# EAGLE schematic Aerobal Schematic v1 (EAGLE 6.3)
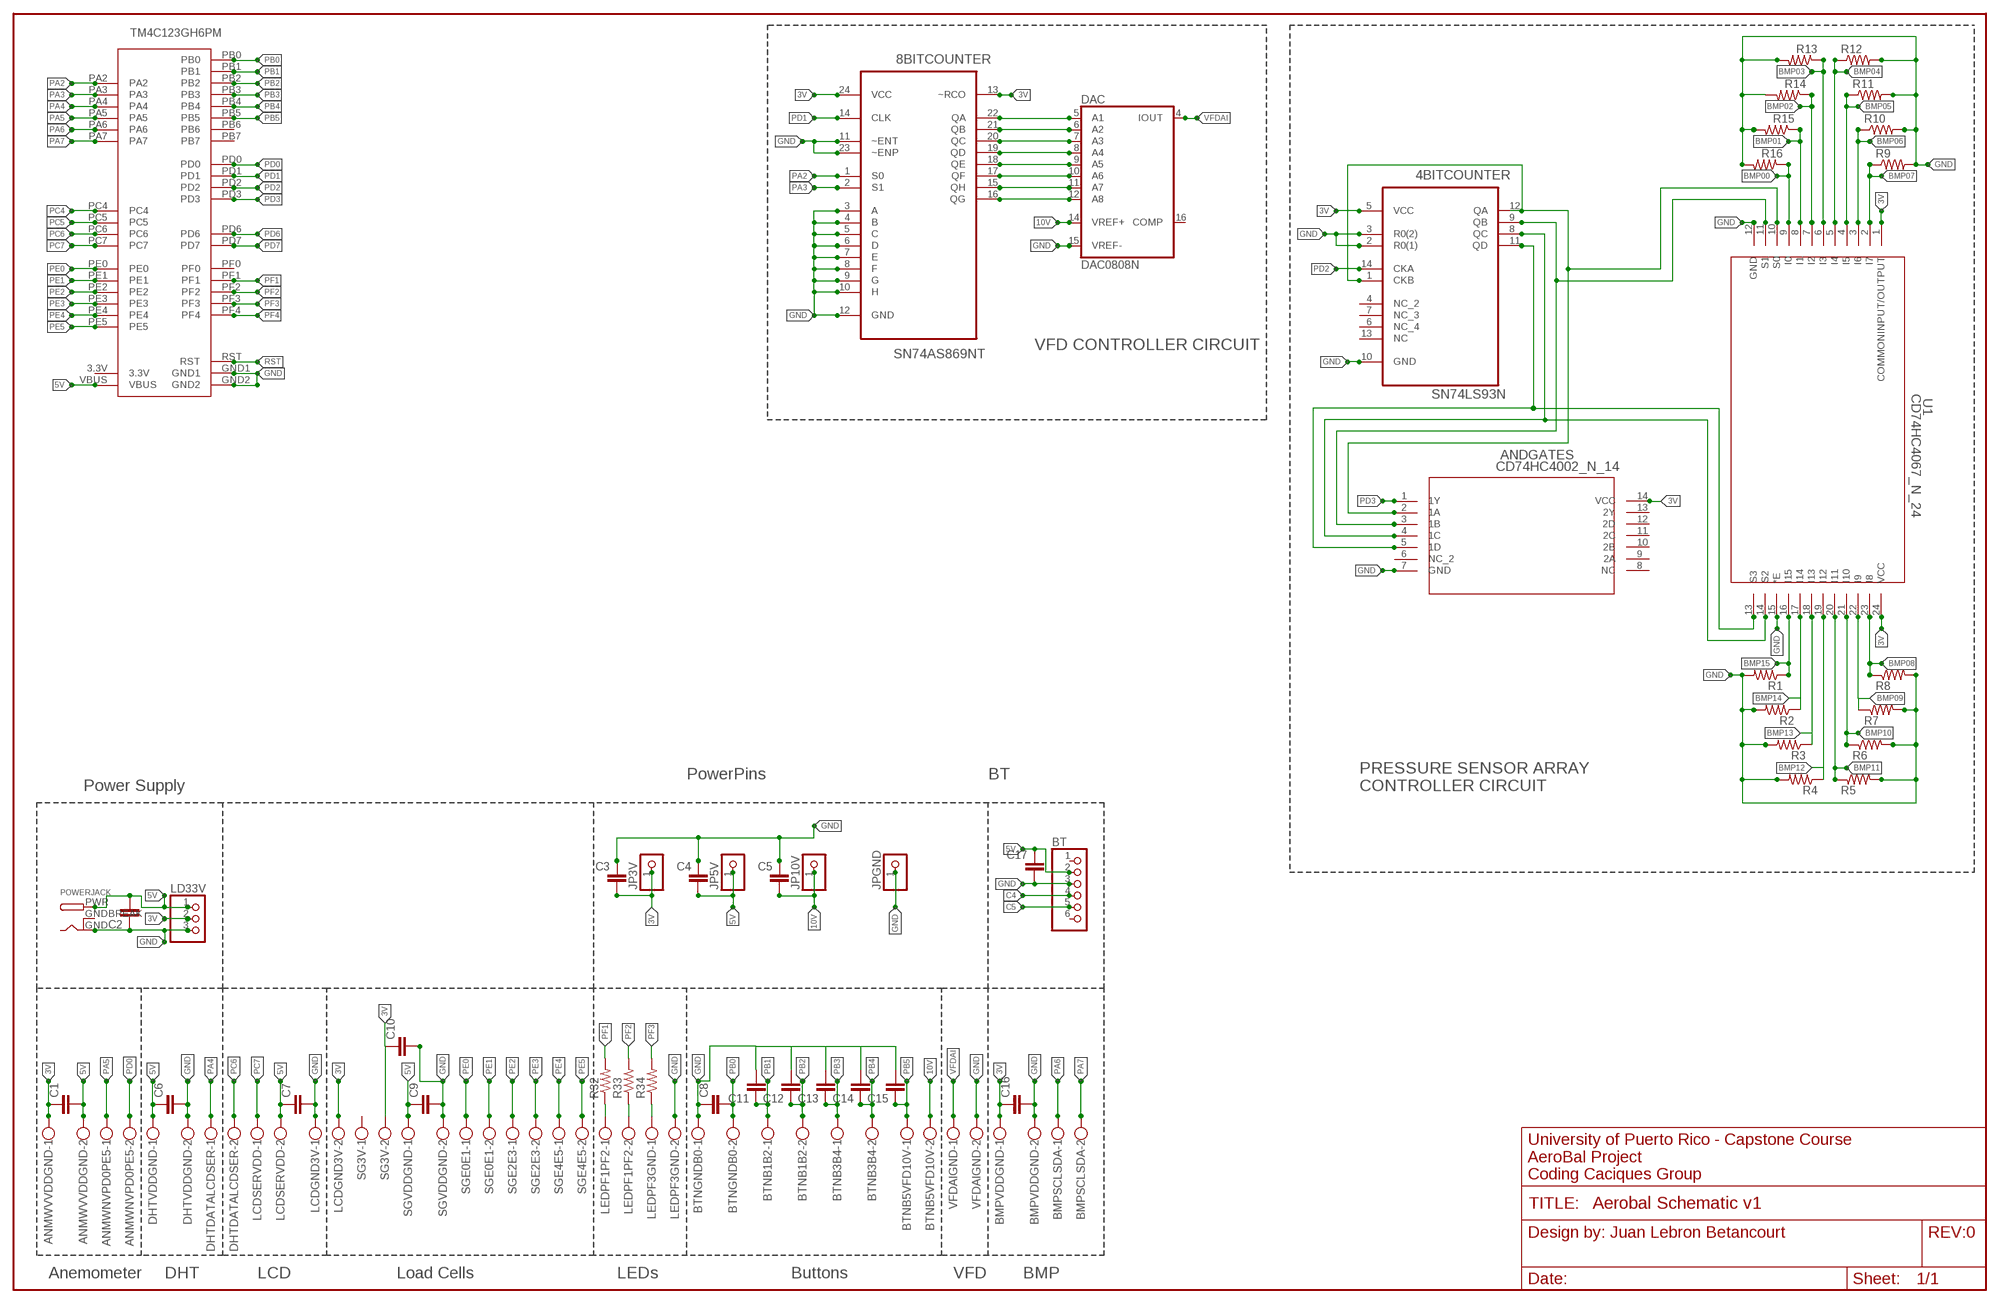
[diagram p0: schematic, sheet 1]

## Parts
4BITCOUNTER  SN74LS93N  [DIP254P762X508-14]
8BITCOUNTER  SN74AS869NT  [DIP254P762X508-24]
ANDGATES  CD74HC4002_N_14  [N14]
ANMWNVPD0PE5  W237-102  [W237-102]
ANMWVVDDGND  W237-102  [W237-102]
BMPSCLSDA  W237-102  [W237-102]
BMPVDDGND  W237-102  [W237-102]
BT  PINHD-1X6  [1X06]
BTNB1B2  W237-102  [W237-102]
BTNB3B4  W237-102  [W237-102]
BTNB5VFD10V  W237-102  [W237-102]
BTNGNDB0  W237-102  [W237-102]
C1  C-EU025-025X050  [C025-025X050]
C2  C-EU025-025X050  [C025-025X050]
C3  C-EU025-025X050  [C025-025X050]
C4  C-EU025-025X050  [C025-025X050]
C5  C-EU025-025X050  [C025-025X050]
C6  C-EU025-025X050  [C025-025X050]
C7  C-EU025-025X050  [C025-025X050]
C8  C-EU025-025X050  [C025-025X050]
C9  C-EU025-025X050  [C025-025X050]
C10  C-EU025-025X050  [C025-025X050]
C11  C-EU025-025X050  [C025-025X050]
C12  C-EU025-025X050  [C025-025X050]
C13  C-EU025-025X050  [C025-025X050]
C14  C-EU025-025X050  [C025-025X050]
C15  C-EU025-025X050  [C025-025X050]
C16  C-EU025-025X050  [C025-025X050]
C17  C-EU025-025X050  [C025-025X050]
DAC  DAC0808N  [DIL16]
DHTDATALCDSER  W237-102  [W237-102]
DHTVDDGND  W237-102  [W237-102]
FRAME1  FRAME-LEDGER  [CREATIVE_COMMONS]
JP3V  PINHD-1X1  [1X01]
JP5V  PINHD-1X1  [1X01]
JP10V  PINHD-1X1  [1X01]
JPGND  PINHD-1X1  [1X01]
LCDGND3V  W237-102  [W237-102]
LCDSERVDD  W237-102  [W237-102]
LD33V  PINHD-1X3  [1X03]
LEDPF1PF2  W237-102  [W237-102]
LEDPF3GND  W237-102  [W237-102]
POWERJACK  DCBARRELPTH  [DCJACK_2MM_PTH]
R1  RESISTORPTH-1/4W  [AXIAL-0.4]
R2  RESISTORPTH-1/4W  [AXIAL-0.4]
R3  RESISTORPTH-1/4W  [AXIAL-0.4]
R4  RESISTORPTH-1/4W  [AXIAL-0.4]
R5  RESISTORPTH-1/4W  [AXIAL-0.4]
R6  RESISTORPTH-1/4W  [AXIAL-0.4]
R7  RESISTORPTH-1/4W  [AXIAL-0.4]
R8  RESISTORPTH-1/4W  [AXIAL-0.4]
R9  RESISTORPTH-1/4W  [AXIAL-0.4]
R10  RESISTORPTH-1/4W  [AXIAL-0.4]
R11  RESISTORPTH-1/4W  [AXIAL-0.4]
R12  RESISTORPTH-1/4W  [AXIAL-0.4]
R13  RESISTORPTH-1/4W  [AXIAL-0.4]
R14  RESISTORPTH-1/4W  [AXIAL-0.4]
R15  RESISTORPTH-1/4W  [AXIAL-0.4]
R16  RESISTORPTH-1/4W  [AXIAL-0.4]
R32  RESISTORPTH-1/4W  [AXIAL-0.4]
R33  RESISTORPTH-1/4W  [AXIAL-0.4]
R34  RESISTORPTH-1/4W  [AXIAL-0.4]
SG3V  W237-102  [W237-102]
SGE0E1  W237-102  [W237-102]
SGE2E3  W237-102  [W237-102]
SGE4E5  W237-102  [W237-102]
SGVDDGND  W237-102  [W237-102]
TM4C123GH6PM  STELLARIS-LAUNCHPADSTELLARIS-LAUNCHPAD  [LAUNCHPAD-XL]
U1  CD74HC4067_N_24  [N24]
VFDAIGND  W237-102  [W237-102]

## Nets
3V: 4BITCOUNTER.5(VCC) 8BITCOUNTER.13(~RCO) 8BITCOUNTER.24(VCC) ANDGATES.14(VCC) ANMWVVDDGND.1 BMPVDDGND.1 C1.1 C3.2 C10.1 C16.1 JP3V.1 LCDGND3V.2 LD33V.2 SG3V.2 U1.1(COMMONINPUT/OUTPUT) U1.24(VCC)
5V: ANMWVVDDGND.2 BT.2 C1.2 C2.2 C4.2 C6.1 C7.1 C9.1 C17.1 DHTVDDGND.1 JP5V.1 LCDSERVDD.2 LD33V.1 POWERJACK.PWR SGVDDGND.1 TM4C123GH6PM.VBUS
10V: BTNB5VFD10V.2 C5.2 DAC.14(VREF+) JP10V.1
BMP00: R16.P$1 U1.9(I0)
BMP01: R15.P$1 U1.8(I1)
BMP02: R14.P$1 U1.7(I2)
BMP03: R13.P$1 U1.6(I3)
BMP04: R12.P$1 U1.5(I4)
BMP05: R11.P$1 U1.4(I5)
BMP06: R10.P$1 U1.3(I6)
BMP07: R9.P$1 U1.2(I7)
BMP08: R8.P$1 U1.23(I8)
BMP09: R7.P$1 U1.22(I9)
BMP10: R6.P$1 U1.21(I10)
BMP11: R5.P$1 U1.20(I11)
BMP12: R4.P$1 U1.19(I12)
BMP13: R3.P$1 U1.18(I13)
BMP14: R2.P$1 U1.17(I14)
BMP15: R1.P$1 U1.16(I15)
C4: BT.4
C5: BT.5
GND: 4BITCOUNTER.2(R0(1)) 4BITCOUNTER.3(R0(2)) 4BITCOUNTER.10(GND) 8BITCOUNTER.3(A) 8BITCOUNTER.4(B) 8BITCOUNTER.5(C) 8BITCOUNTER.6(D) 8BITCOUNTER.7(E) 8BITCOUNTER.8(F) 8BITCOUNTER.9(G) 8BITCOUNTER.10(H) 8BITCOUNTER.11(~ENT) 8BITCOUNTER.12(GND) 8BITCOUNTER.23(~ENP) ANDGATES.7(GND) BMPVDDGND.2 BT.3 BTNGNDB0.1 C2.1 C3.1 C4.1 C5.1 C6.2 C7.2 C8.1 C9.2 C10.2 C11.2 C12.2 C13.2 C14.2 C15.2 C16.2 C17.2 DAC.15(VREF-) DHTVDDGND.2 JPGND.1 LCDGND3V.1 LD33V.3 LEDPF3GND.2 POWERJACK.GND R1.P$2 R2.P$2 R3.P$2 R4.P$2 R5.P$2 R6.P$2 R7.P$2 R8.P$2 R9.P$2 R10.P$2 R11.P$2 R12.P$2 R13.P$2 R14.P$2 R15.P$2 R16.P$2 SGVDDGND.2 TM4C123GH6PM.GND1 TM4C123GH6PM.GND2 U1.12(GND) U1.15(*E) VFDAIGND.2
N$1: LEDPF1PF2.1 R32.P$1
N$3: LEDPF1PF2.2 R33.P$1
N$4: LEDPF3GND.1 R34.P$1
N$51: 4BITCOUNTER.11(QD) ANDGATES.5(1D) U1.13(S3)
N$52: 4BITCOUNTER.8(QC) ANDGATES.4(1C) U1.14(S2)
N$53: 4BITCOUNTER.9(QB) ANDGATES.3(1B) U1.11(S1)
N$54: 4BITCOUNTER.1(CKB) 4BITCOUNTER.12(QA) ANDGATES.2(1A) U1.10(S0)
N$55: 8BITCOUNTER.22(QA) DAC.5(A1)
N$56: 8BITCOUNTER.21(QB) DAC.6(A2)
N$57: 8BITCOUNTER.20(QC) DAC.7(A3)
N$58: 8BITCOUNTER.19(QD) DAC.8(A4)
N$59: 8BITCOUNTER.18(QE) DAC.9(A5)
N$60: 8BITCOUNTER.17(QF) DAC.10(A6)
N$61: 8BITCOUNTER.15(QH) DAC.11(A7)
N$62: 8BITCOUNTER.16(QG) DAC.12(A8)
PA2: 8BITCOUNTER.1(S0) TM4C123GH6PM.PA2
PA3: 8BITCOUNTER.2(S1) TM4C123GH6PM.PA3
PA4: DHTDATALCDSER.1 TM4C123GH6PM.PA4
PA5: ANMWNVPD0PE5.1 TM4C123GH6PM.PA5
PA6: BMPSCLSDA.1 TM4C123GH6PM.PA6
PA7: BMPSCLSDA.2 TM4C123GH6PM.PA7
PB0: BTNGNDB0.2 C8.2 TM4C123GH6PM.PB0
PB1: BTNB1B2.1 C11.1 TM4C123GH6PM.PB1
PB2: BTNB1B2.2 C12.1 TM4C123GH6PM.PB2
PB3: BTNB3B4.1 C13.1 TM4C123GH6PM.PB3
PB4: BTNB3B4.2 C14.1 TM4C123GH6PM.PB4
PB5: BTNB5VFD10V.1 C15.1 TM4C123GH6PM.PB5
PC4: TM4C123GH6PM.PC4
PC5: TM4C123GH6PM.PC5
PC6: DHTDATALCDSER.2 TM4C123GH6PM.PC6
PC7: LCDSERVDD.1 TM4C123GH6PM.PC7
PD0: ANMWNVPD0PE5.2 TM4C123GH6PM.PD0
PD1: 8BITCOUNTER.14(CLK) TM4C123GH6PM.PD1
PD2: 4BITCOUNTER.14(CKA) TM4C123GH6PM.PD2
PD3: ANDGATES.1(1Y) TM4C123GH6PM.PD3
PD6: TM4C123GH6PM.PD6
PD7: TM4C123GH6PM.PD7
PE0: SGE0E1.1 TM4C123GH6PM.PE0
PE1: SGE0E1.2 TM4C123GH6PM.PE1
PE2: SGE2E3.1 TM4C123GH6PM.PE2
PE3: SGE2E3.2 TM4C123GH6PM.PE3
PE4: SGE4E5.1 TM4C123GH6PM.PE4
PE5: SGE4E5.2 TM4C123GH6PM.PE5
PF1: R32.P$2 TM4C123GH6PM.PF1
PF2: R33.P$2 TM4C123GH6PM.PF2
PF3: R34.P$2 TM4C123GH6PM.PF3
PF4: TM4C123GH6PM.PF4
RST: TM4C123GH6PM.RST
VFDAI: DAC.4(IOUT) VFDAIGND.1
Unconnected: 4BITCOUNTER.4(NC_2) 4BITCOUNTER.6(NC_4) 4BITCOUNTER.7(NC_3) 4BITCOUNTER.13(NC) ANDGATES.6(NC_2) ANDGATES.8(NC) ANDGATES.9(2A) ANDGATES.10(2B) ANDGATES.11(2C) ANDGATES.12(2D) ANDGATES.13(2Y) BT.1 BT.6 DAC.16(COMP) SG3V.1 TM4C123GH6PM.PB6 TM4C123GH6PM.PB7 TM4C123GH6PM.PF0

## Notes on the sheet
- VFD CONTROLLER CIRCUIT
- PowerPins | BT
- Power Supply
- PRESSURE SENSOR ARRAY 
  CONTROLLER CIRCUIT
- Anemometer | DHT | LCD | Load Cells | LEDs | Buttons | VFD | BMP

## Power pins joined to a net without a drawn wire
3.3V: TM4C123GH6PM.3.3V
GND: DAC.2(GND)
GNDBREAK: POWERJACK.GNDBREAK
VCC: DAC.13(VCC)
VEE: DAC.3(VEE)

## Library data of the parts
4BITCOUNTER = Texas Instruments_By_element14_Batch_1:SN74LS93N: DECADE, DIVIDE-BY-TWELVE AND BINARY COUNTERS; MPN: SN74LS93N; OC_FARNELL: 1470792; OC_NEWARK: 60K6898; PACKAGE: DIP-14; SUPPLIER: Texas Instruments
8BITCOUNTER = Texas Instruments_By_element14_Batch_1:SN74AS869NT: 8-BIT SYNC UP/DOWN COUNTER; MPN: SN74AS869NT; OC_FARNELL: -; OC_NEWARK: 67K1061; PACKAGE: DIP-24; SUPPLIER: TEXAS INSTRUMENTS
ANDGATES = cd74hc4002e:CD74HC4002_N_14; DATASHEETURL: http://www.ti.com/lit/gpn/CD74HC4002; DESCRIPTION: High Speed CMOS Logic Dual 4-Input NOR Gates; FAMILY_NAME: NOR GATE; GENERIC_PART_NUMBER: CD74HC4002; INDUSTRY_STD_PKG_TYPE: PDIP; MANUFACTURER: Texas Instruments; PACKAGE_DESIGNATOR: N; PIN_COUNT: 14
ANMWNVPD0PE5 ANMWVVDDGND BMPSCLSDA BMPVDDGND BTNB1B2 BTNB3B4 BTNB5VFD10V BTNGNDB0 DHTDATALCDSER DHTVDDGND LCDGND3V LCDSERVDD LEDPF1PF2 LEDPF3GND SG3V SGE0E1 SGE2E3 SGE4E5 SGVDDGND VFDAIGND = con-wago-500:W237-102: WAGO SCREW CLAMP; MPN: 237-102; OC_FARNELL: unknown; OC_NEWARK: 70K9898
BT = pinhead:PINHD-1X6: PIN HEADER
C1-C17 = rcl:C-EU: CAPACITOR, European symbol
DAC = linear:DAC0808: 8-bit DIGITAL/ANALOG CONVERTER Source: http://www.national.com/ds/DA/DAC0808.pdf
FRAME1 = SparkFun-Aesthetics:FRAME-LEDGER: Schematic Frame Standard 11x14 US Ledger frame
JP3V JP5V JP10V JPGND = pinhead:PINHD-1X1: PIN HEADER
LD33V = pinhead:PINHD-1X3: PIN HEADER
POWERJACK = a.adafruit:DCBARREL: 2.0mm DC Barrel Jack DCJACK_2MM_PTH - Through Hole Jack (4UConnector: 05537)
R1-R16 R32-R34 = SparkFun-Resistors:RESISTOR: Resistor Basic schematic elements and footprints for 0603, 1206, and PTH resistors.
TM4C123GH6PM = a.tiva:STELLARIS-LAUNCHPAD: Stellaris Launchpad LM4F120 using all header pins to connect to XL booster packs.
U1 = CD74HC4067:CD74HC4067_N_24; DATASHEETURL: http://www.ti.com/lit/gpn/CD74HC4067; DESCRIPTION: High Speed CMOS 16-Channel Analog Multiplexer/Demultiplexer; FAMILY_NAME: ANALOG SWITCH/MULTIPLEXER(less than or equal to 5V); GENERIC_PART_NUMBER: CD74HC4067; INDUSTRY_STD_PKG_TYPE: PDIP; MANUFACTURER: Texas Instruments; PACKAGE_DESIGNATOR: N; PIN_COUNT: 24